# EAGLE design traktor (EAGLE 9.0.1)
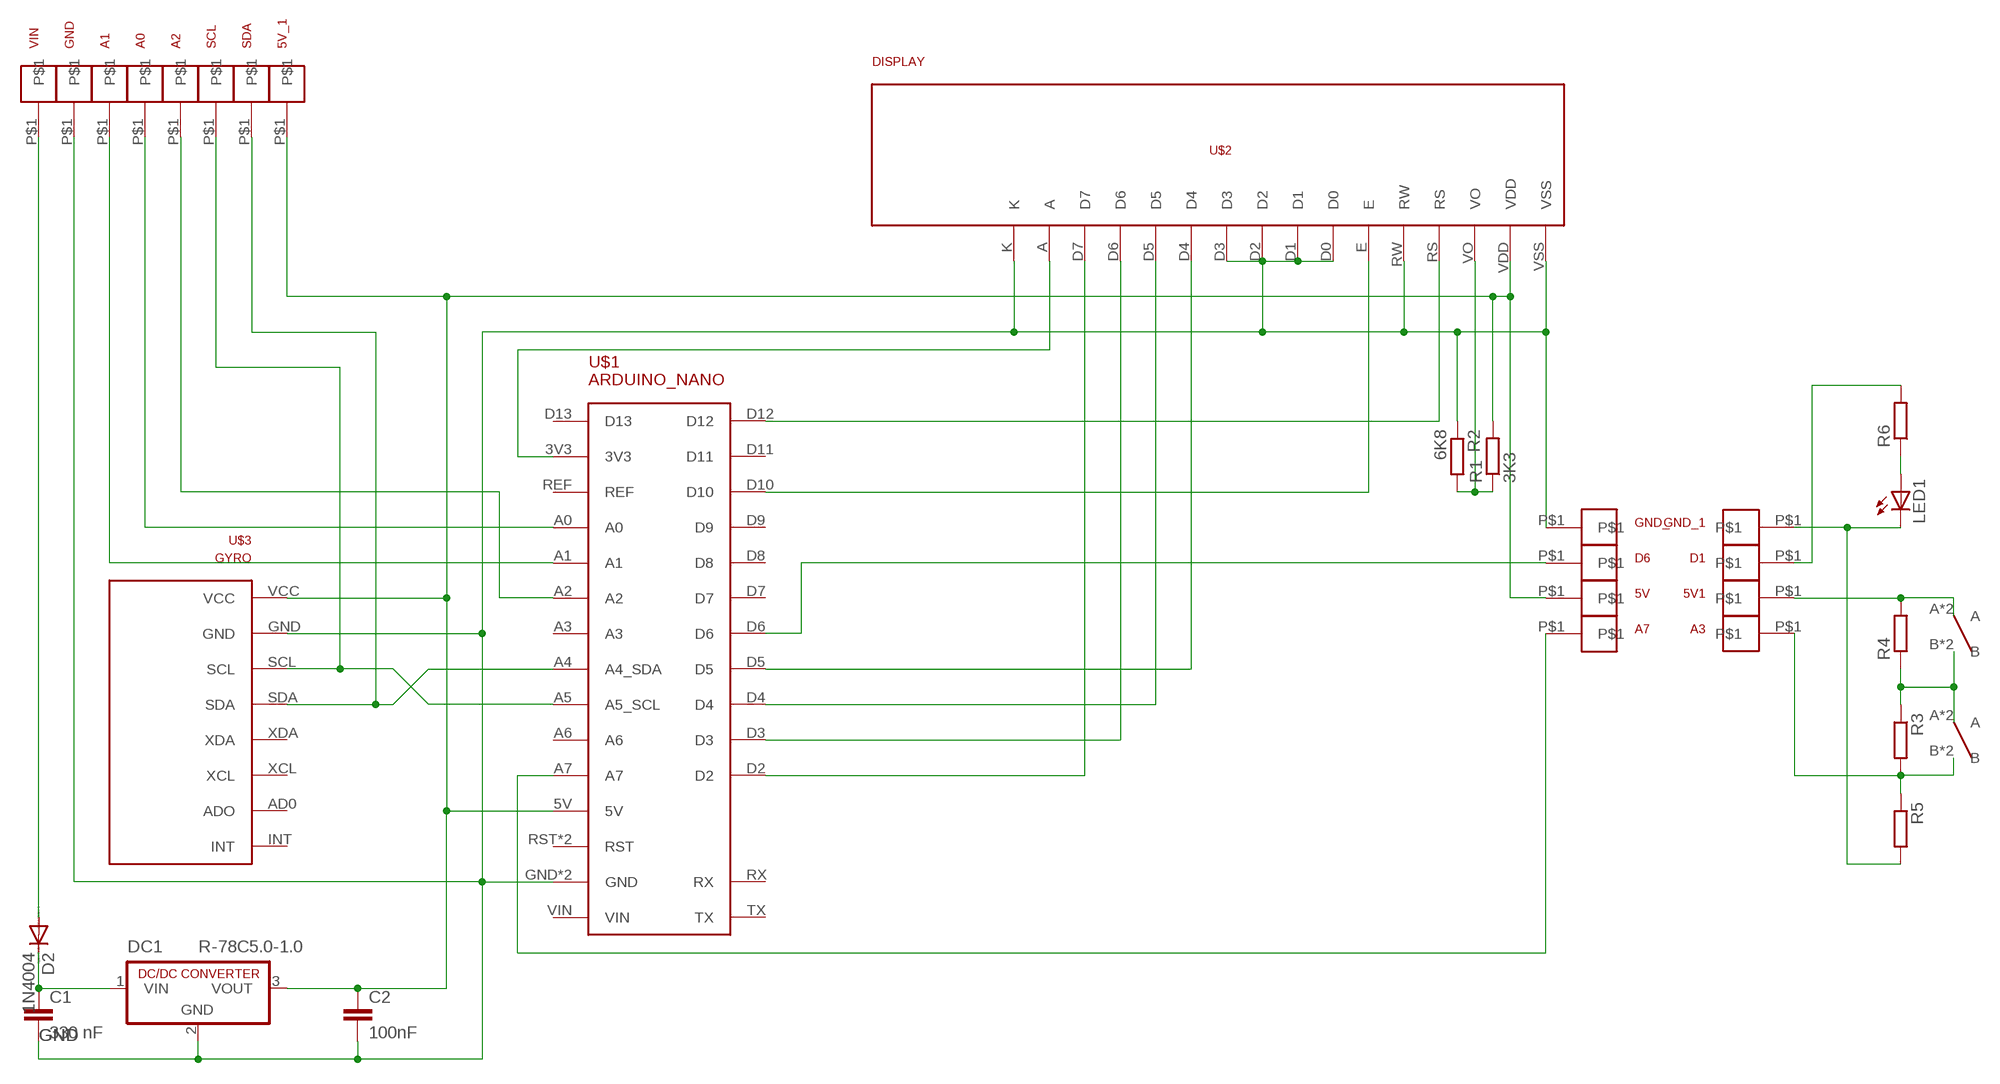
[diagram p0: schematic, sheet 1]

## Parts
5V  I_O_PIN  [I_O_PIN]
5V1  I_O_PIN  [I_O_PIN]
5V_1  I_O_PIN  [I_O_PIN]
A0  I_O_PIN  [I_O_PIN]
A1  I_O_PIN  [I_O_PIN]
A2  I_O_PIN  [I_O_PIN]
A3  I_O_PIN  [I_O_PIN]
A7  I_O_PIN  [I_O_PIN]
C1  330 nF  C-EUC0805  [C0805]
C2  100nF  C-EUC0805  [C0805]
D1  I_O_PIN  [I_O_PIN]
D2  1N4004  [DO41-10]
D6  I_O_PIN  [I_O_PIN]
DC1  R-78C5.0-1.0  [SIP3]
GND  I_O_PIN  [I_O_PIN]
GND_  I_O_PIN  [I_O_PIN]
GND_1  I_O_PIN  [I_O_PIN]
LED1  LED5MM  [LED5MM]
R1  3K3  R-EU_R0603  [R0603]
R2  6K8  R-EU_R0603  [R0603]
R3  R-EU_R0805  [R0805]
R4  R-EU_R0805  [R0805]
R5  R-EU_R0805  [R0805]
R6  R-EU_R0805  [R0805]
SCL  I_O_PIN  [I_O_PIN]
SDA  I_O_PIN  [I_O_PIN]
U$1  ARDUINO_NANO  [ARDUINO_NANO]
U$2  DISPLAY  [DISPLAY]
U$3  GYRO  [GYRO]
U$4  BUTTON  [BUTTON]
U$6  BUTTON  [BUTTON]
VIN  I_O_PIN  [I_O_PIN]

## Nets
5V: 5V.P$1 5V_1.P$1 C2.1 DC1.3(VOUT) R1.2 U$1.5V U$2.VDD U$3.VCC
GND: C1.2 C2.2 DC1.2(GND) GND.P$1 GND_.P$1 R2.1 U$1.GND U$1.GND2(GND) U$2.D0 U$2.D1 U$2.D2 U$2.D3 U$2.K U$2.RW U$2.VSS U$3.GND
GND1: GND_1.P$1 LED1.K(C) R5.2
N$1: A2.P$1 U$1.A2
N$2: U$1.3V3 U$2.A
N$3: U$1.D2 U$2.D7
N$4: U$1.D3 U$2.D6
N$5: U$1.D4 U$2.D5
N$6: U$1.D5 U$2.D4
N$7: U$1.D10 U$2.E
N$8: U$1.D12 U$2.RS
N$9: A7.P$1 U$1.A7
N$10: R1.1 R2.2 U$2.VO
N$11: SDA.P$1 U$1.A4(A4_SDA) U$3.SDA
N$12: SCL.P$1 U$1.A5(A5_SCL) U$3.SCL
N$13: C1.1 D2.C DC1.1(VIN)
N$14: A0.P$1 U$1.A0
N$15: A1.P$1 U$1.A1
N$17: D6.P$1 U$1.D6
N$18: A3.P$1 R3.2 R5.1 U$4.B U$4.BB(B)
N$19: R3.1 R4.1 U$4.A U$4.AA(A) U$6.B U$6.BB(B)
N$20: 5V1.P$1 R4.2 U$6.A U$6.AA(A)
N$21: LED1.A R6.1
N$22: D1.P$1 R6.2
VIN: D2.A VIN.P$1
Unconnected: U$1.A3 U$1.A6 U$1.D7 U$1.D8 U$1.D9 U$1.D11 U$1.D13 U$1.REF U$1.RST U$1.RST_2(RST) U$1.RX U$1.TX U$1.VIN U$3.AD0(ADO) U$3.INT U$3.XCL U$3.XDA

## Library data of the parts
5V 5V1 5V_1 A0 A1-A3 A7 D1 D6 GND GND_ GND_1 SCL SDA VIN = traktor:I_O_PIN
C1 C2 = resistor:C-EU: CAPACITOR, European symbol
D2 = diode:1N4004: DIODE general purpose rectifier, 1 A
DC1 = dc-dc-converter:R-78C*-1.0: INNOLINE DC/DC-Converter 1.0 AMP SIP3 Single Output Source: Data sheet <http://www.mikrocontroller.net/attachment/150645/157764-da-01-en-DC_DC_WANDLER_R_78C5_0_1_0.pdf>
LED1 = led:LED: LED OSRAM: - CHIPLED LG R971, LG N971, LY N971, LG Q971, LY Q971, LO R971, LY R971 LH N974, LH R974 LS Q976, LO Q976, LY Q976 LO Q996 - Hyper CHIPLED LW Q18S LB Q993, LB Q99A, LB R99A - SideLED LS A670, LO A670, LY A670, LG A670, LP A670 LB A673, LV A673, LT A673, LW A673 LH A674 LY A675 LS A676, LA A676, LO A676, LY A676, LW A676 LS A679, LY A679, LG A679 - Hyper Micro SIDELED® LS Y876, LA Y876, LO Y876, LY Y876 LT Y87S - SmartLED LW L88C, LW L88S LB L89C, LB L89S, LG L890 LS L89K, LO L89K, LY L89K LS L896, LA L896, LO L896, LY L896 - TOPLED LS T670, LO T670, LY T670, LG T670, LP T670 LSG T670, LSP T670, LSY T670, LOP T670, LYG T670 LG T671, LOG T671, LSG T671 LB T673, LV T673, LT T673, LW T673 LH T674 LS T676, LA T676, LO T676, LY T676, LB T676, LH T676, LSB T676, LW T676 LB T67C, LV T67C, LT T67C, LS T67K, LO T67K, LY T67K, LW E67C LS E67B, LA E67B, LO E67B, LY E67B, LB E67C, LV E67C, LT E67C LW T67C LS T679, LY T679, LG T679 LS T770, LO T770, LY T770, LG T770, LP T770 LB T773, LV T773, LT T773, LW T773 LH T774 LS E675, LA E675, LY E675, LS T675 LS T776, LA T776, LO T776, LY T776, LB T776 LHGB T686 LT T68C, LB T68C - Hyper Mini TOPLED® LB M676 - Mini TOPLED Santana® LG M470 LS M47K, LO M47K, LY M47K Source: http://www.osram.convergy.de LUXEON: - LUMILED® LXK2-PW12-R00, LXK2-PW12-S00, LXK2-PW14-U00, LXK2-PW14-V00 LXK2-PM12-R00, LXK2-PM12-S00, LXK2-PM14-U00 LXK2-PE12-Q00, LXK2-PE12-R00, LXK2-PE12-S00, LXK2-PE14-T00, LXK2-PE14-U00 LXK2-PB12-K00, LXK2-PB12-L00, LXK2-PB12-M00, LXK2-PB14-N00, LXK2-PB14-P00, LXK2-PB14-Q00 LXK2-PR12-L00, LXK2-PR12-M00, LXK2-PR14-Q00, LXK2-PR14-R00 LXK2-PD12-Q00, LXK2-PD12-R00, LXK2-PD12-S00 LXK2-PH12-R00, LXK2-PH12-S00 LXK2-PL12-P00, LXK2-PL12-Q00, LXK2-PL12-R00 Source: www.luxeon.com KINGBRIGHT: KA-3528ASYC Source: www.kingbright.com
R1-R6 = resistor:R-EU_: RESISTOR, European symbol
U$1 = traktor:ARDUINO_NANO
U$2 = traktor:DISPLAY
U$3 = traktor:GYRO
U$4 U$6 = traktor:BUTTON

## Board
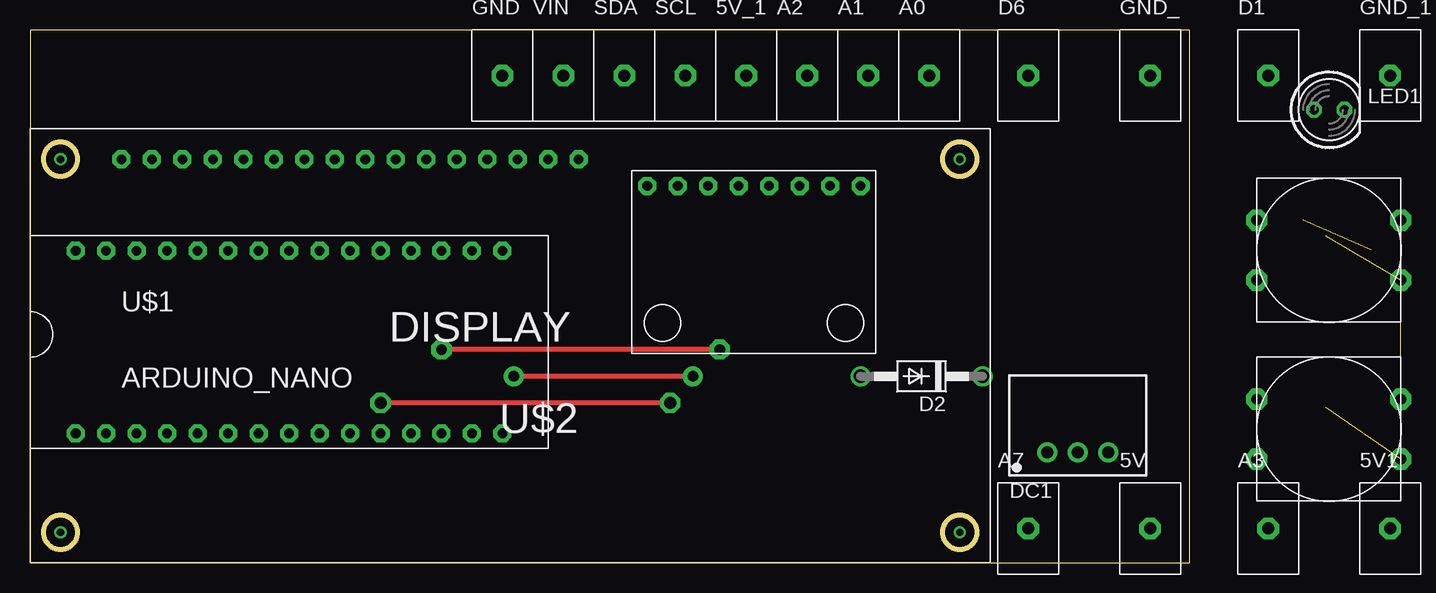
[diagram p1: board, top side]
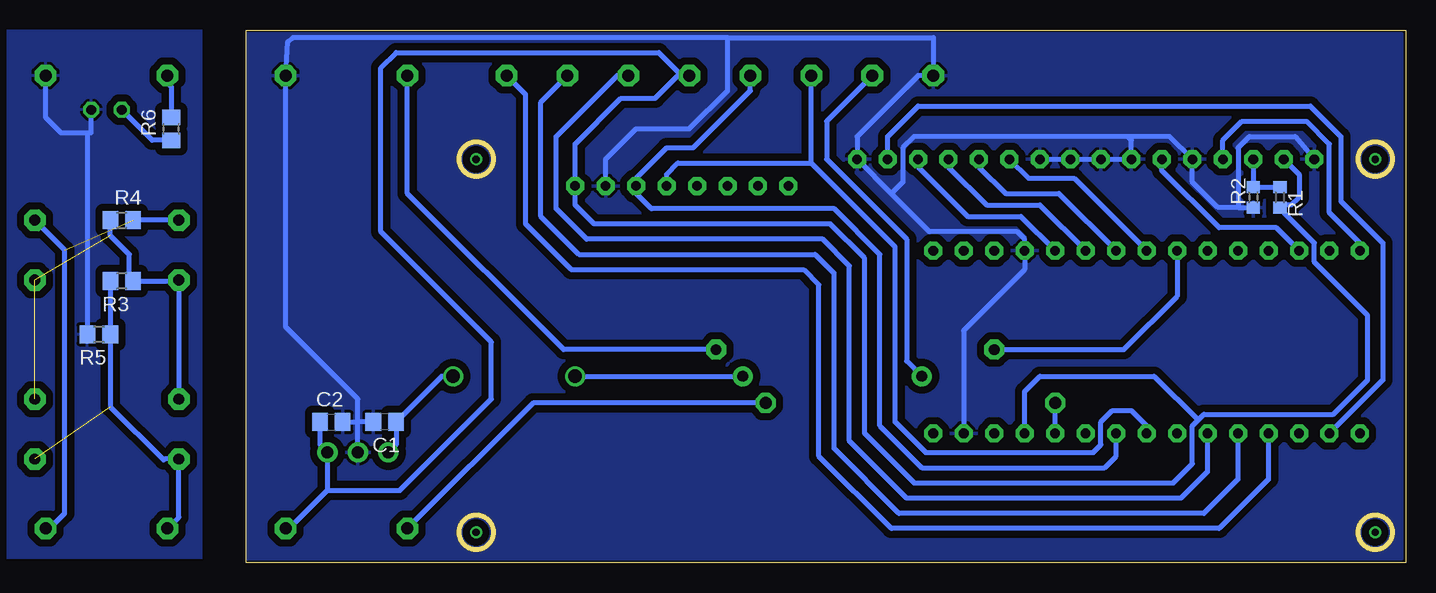
[diagram p2: board, bottom side, seen from below]

Size 96.64 x 44.44 mm. Coordinates in mm from the lower left corner, seen from the top.
Outline: 0,0 96.64,0 96.64,44.44 0,44.44 0,0
Outline: circle at 2.54,33.66 radius 1.42
Outline: circle at 2.54,2.54 radius 1.42
Outline: circle at 77.47,2.54 radius 1.42
Outline: circle at 77.47,33.66 radius 1.42
Copper layers (1*16): Top 0.035mm / dielectric 1.5mm / Bottom 0.035mm
Design rules "default *": minimum track width 10mil, minimum drill 24mil, track to track 8mil, track to pad 8mil, pad to pad 8mil, via to via 8mil, smd to smd 8mil, copper to edge 0mil, drill to drill 4mil, minimum pad ring 10mil, minimum via ring 8mil, stop-mask expansion 4mil, vias tented up to drill 0mil, thermal gap 10mil

### Footprints (pad centres in the part's own frame; a part is rotated, then mirrored left to right if it is on the bottom)
I_O_PIN = drill 1 pad 1.8 octagon: P$1 0,0
C0805 = smd 1.3 x 1.5: 1 -0.95,0; 2 0.95,0
DO41-10 = drill 1.118: A 5.08,0; C -5.08,0
SIP3 = drill 1 pad 1.676: 1 -2.54,0; 2 0,0; 3 2.54,0
LED5MM = drill 0.813 octagon: A -1.27,0; K 1.27,0
R0603 = smd 1 x 1.1: 1 -0.85,0; 2 0.85,0
R0805 = smd 1.3 x 1.5: 1 -0.95,0; 2 0.95,0
ARDUINO_NANO = drill 0.8 pad 1.5 octagon: 3V3 -15.24,-7.62; 5V 10.16,-7.62; A0 -10.16,-7.62; A1 -7.62,-7.62; A2 -5.08,-7.62; A3 -2.54,-7.62; A4 0,-7.62; A5 2.54,-7.62; A6 5.08,-7.62; A7 7.62,-7.62; D2 7.62,7.62; D3 5.08,7.62; D4 2.54,7.62; D5 0,7.62; D6 -2.54,7.62; D7 -5.08,7.62; D8 -7.62,7.62; D9 -10.16,7.62; D10 -12.7,7.62; D11 -15.24,7.62; D12 -17.78,7.62; D13 -17.78,-7.62; GND 15.24,-7.62; GND2 10.16,7.62; REF -12.7,-7.62; RST 12.7,-7.62; RST_2 12.7,7.62; RX 15.24,7.62; TX 17.78,7.62; VIN 17.78,-7.62
DISPLAY = drill 0.8 pad 1.5 octagon: A -2.54,-17.78; D0 17.78,-17.78; D1 15.24,-17.78; D2 12.7,-17.78; D3 10.16,-17.78; D4 7.62,-17.78; D5 5.08,-17.78; D6 2.54,-17.78; D7 0,-17.78; E 20.32,-17.78; K -5.08,-17.78; RS 25.4,-17.78; RW 22.86,-17.78; VDD 30.48,-17.78; VO 27.94,-17.78; VSS 33.02,-17.78
GYRO = drill 0.8 pad 1.5 octagon: AD0 6.35,-6.35; GND -6.35,-6.35; INT 8.89,-6.35; SCL -3.81,-6.35; SDA -1.27,-6.35; VCC -8.89,-6.35; XCL 3.81,-6.35; XDA 1.27,-6.35
BUTTON = drill 0.9 pad 1.778 octagon: A 0,0; AA 0,12; B 5,0; BB 5,12

### Placement (x,y rotation side)
5V  93.34,2.86 0 top
5V1  113.35,2.86 0 top  (outside the outline)
5V_1  59.69,40.64 0 top
A0  74.93,40.64 0 top
A1  69.85,40.64 0 top
A2  64.77,40.64 0 top
A3  103.19,2.86 0 top  (outside the outline)
A7  83.19,2.86 0 top
C1  85.09,11.75 180 bottom
C2  89.53,11.75 0 bottom
D1  103.19,40.64 0 top  (outside the outline)
D2  74.3,15.56 180 top
D6  83.19,40.64 0 top
DC1  87.31,9.21 0 top
GND  39.37,40.64 0 top
GND_  93.34,40.64 0 top
GND_1  113.35,40.64 0 top  (outside the outline)
LED1  108.27,37.78 0 top  (outside the outline)
R1  10.48,30.48 270 bottom
R2  12.7,30.48 90 bottom
R3  107,23.5 180 bottom  (outside the outline)
R4  107,28.57 0 bottom  (outside the outline)
R5  108.9,19.05 180 bottom  (outside the outline)
R6  102.87,36.2 90 bottom  (outside the outline)
SCL  54.61,40.64 0 top
SDA  49.53,40.64 0 top
U$1  21.59,18.41 0 top
U$2  40.64,15.88 180 top
U$3  60.33,25.08 180 top
U$4  102.23,13.65 270 top  (outside the outline)
U$6  102.23,28.57 270 top  (outside the outline)
VIN  44.45,40.64 0 top

### Tracks (layer width: path | path; a pad name or v marks a point on that pad's centre or on a via)
5V
  Bottom 0.406: U$2.VDD 8.89,32.38 8.89,30.48 9.53,29.84 9.95,29.84 R1.2 10.16,29.21 7.62,26.67 7.62,25.08 3.17,20.64 3.17,15.24 6.03,12.38 16.83,12.38 17.3,11.91 | 17.3,11.91 17.78,11.43 17.78,8.26 19.37,6.67 40.96,6.67 45.09,10.79 45.09,25.4 47.94,28.26 67.63,28.26 69.22,29.84 U$3.VCC 69.22,34.92 65.41,38.73 62.55,38.73 60.64,40.64 60.33,40.64 | U$1.5V 31.75,14.29 30.48,15.56 20.95,15.56 17.3,11.91 | 89.85,6.03 83.82,6.03 76.2,13.65 76.2,18.41 85.41,27.62 85.41,41.27 84.14,42.55 62.23,42.55 60.33,40.64 | 89.85,6.03 DC1.3 90.49,9.84 90.49,11.11 90.48,11.12 C2.1 | 60.33,40.64 5V_1.P$1 | 89.85,6.03 93.03,2.86 5V.P$1
GND
  Bottom 0.406: 13.97,29.63 R2.1 | 13.97,29.63 15.66,29.63 17.78,31.75 U$2.RW 19.68,35.56 23.18,35.56 | 42.86,30.8 39.69,27.62 32.38,27.62 31.75,26.99 U$1.GND2 31.75,24.45 36.83,19.37 U$1.GND | 13.97,29.63 13.97,34.61 13.02,35.56 9.21,35.56 U$2.VSS | 56.52,43.81 92.71,43.81 93.16,43.46 GND_.P$1 93.34,19.68 87.31,13.65 87.31,11.75 | 56.52,43.81 39.37,43.81 GND.P$1 40.64,40.64 45.72,35.56 U$2.K 42.86,30.8 | U$3.GND 66.67,33.66 64.14,36.2 59.69,36.2 56.52,39.37 56.52,43.81 | 42.86,30.8 41.91,31.75 41.91,34.61 40.96,35.56 23.18,35.56 | U$2.D3 U$2.D2 U$2.D1 U$2.D0 22.86,35.24 23.18,35.56 | DC1.2 87.31,11.75 | C1.2 87.31,11.75 | C2.2 87.31,11.75
  pour Bottom (isolate 0.6): 0.32,44.13 0.32,0.32 96.52,0.32 96.52,44.13
GND1
  Bottom 0.406: GND_1.P$1 113.35,37.15 112.08,35.88 109.85,35.88 | 109.85,35.88 R5.2 | 109.85,35.88 109.54,35.88 LED1.K
  pour Bottom (isolate 0.61): 100.33,44.45 100.33,0.32 116.52,0.32 116.52,44.45
N$1
  Bottom 0.406: U$1.A2 16.51,7.62 18.73,5.4 41.59,5.4 46.35,10.16 46.35,24.77 48.58,26.99 68.26,26.99 70.8,29.53 70.8,35.56 65.72,40.64 A2.P$1
N$2
  Bottom 0.406: U$2.A 43.18,35.56 40.64,38.1 7.94,38.1 5.4,35.56 5.4,30.16 1.91,26.67 1.91,15.24 U$1.3V3
N$3
  Bottom 0.406: U$2.D7 40.64,33.02 36.51,28.89 32.07,28.89 U$1.D2
N$4
  Bottom 0.406: U$2.D6 38.1,33.02 34.92,29.84 30.48,29.84 U$1.D3
N$5
  Bottom 0.406: U$2.D5 35.56,33.02 33.34,30.8 28.89,30.8 U$1.D4
N$6
  Bottom 0.406: U$2.D4 31.43,32.07 27.62,32.07 U$1.D5
N$7
  Bottom 0.406: U$1.D10 10.79,27.94 15.56,27.94 20.32,32.7 U$2.E
N$8
  Bottom 0.406: U$2.RS 15.24,35.24 13.65,36.83 8.26,36.83 6.35,34.92 6.35,29.21 3.81,26.67 U$1.D12
N$9  (via drill 1 pad 1.68)
  Top 0.406: v53.34,13.34 v29.21,13.34
  Bottom 0.406: U$1.A7 v29.21,13.34 | v53.34,13.34 72.71,13.34 A7.P$1
N$10
  Bottom 0.406: R1.1 R2.2 U$2.VO
N$11
  Bottom 0.406: U$1.A4 21.59,11.43 22.86,12.7 24.45,12.7 25.4,11.75 25.4,9.84 26.04,9.21 40.01,9.21 42.55,11.75 42.55,26.35 49.53,33.34 | 49.53,33.34 SDA.P$1 | U$3.SDA 61.59,32.38 60.64,33.34 49.53,33.34
N$12
  Bottom 0.406: SCL.P$1 54.61,39.37 59.37,34.61 61.59,34.61 64.14,32.07 U$3.SCL 64.14,30.8 62.87,29.53 47.62,29.53 43.81,25.72 43.81,11.43 40.32,7.94 25.08,7.94 24.13,8.89 U$1.A5
N$13
  Bottom 0.406: D2.C 80.33,15.56 C1.1 84.14,9.84 DC1.1
N$14
  Bottom 0.406: U$1.A0 11.43,6.99 15.56,2.86 42.86,2.86 48.9,8.89 48.9,23.18 50.16,24.45 69.53,24.45 73.34,28.26 73.34,39.05 A0.P$1
N$15
  Bottom 0.406: U$1.A1 13.97,6.99 16.83,4.13 42.23,4.13 47.62,9.53 47.62,24.13 49.21,25.72 68.9,25.72 72.07,28.89 72.07,38.42 A1.P$1
N$17  (via drill 0.9 pad 1.68)
  Top 0.406: v57.47,17.78 v34.29,17.78
  Bottom 0.406: D6.P$1 83.19,30.8 70.17,17.78 v57.47,17.78 | U$1.D6 19.05,22.23 23.5,17.78 v34.29,17.78
N$18  (1 unrouted)
  Bottom 0.406: A3.P$1 102.23,3.81 U$4.B 103.42,8.65 103.5,8.57 107.95,13.02 R5.1 107.95,20.64 R3.2
N$19  (2 unrouted)
  Bottom 0.406: U$4.A U$6.B 102.31,23.5 R3.1 106.36,23.5 106.36,25.72 107.95,27.3 R4.1
N$20  (1 unrouted)
  Bottom 0.406: U$6.A R4.2 | U$6.AA 111.76,26.1 111.76,6.99 111.76,4.13 113.35,2.54 5V1.P$1
N$21
  Bottom 0.406: R6.1 104.46,35.24 LED1.A
N$22
  Bottom 0.406: D1.P$1 103.5,40.32 102.87,39.69 R6.2
N$23  (via drill 0.6)
  other vias: 2.54,33.66
N$24  (via drill 0.6)
  other vias: 2.54,2.54
N$25  (via drill 0.6)
  other vias: 77.47,2.54
N$26  (via drill 0.6)
  other vias: 77.47,33.66
VIN  (via drill 0.9 pad 1.68)
  Top 0.406: v55.24,15.56 v40.32,15.56
  Bottom 0.406: D2.A v55.24,15.56 | VIN.P$1 48.26,36.83 48.26,33.66 41.59,26.99 41.59,16.83 v40.32,15.56